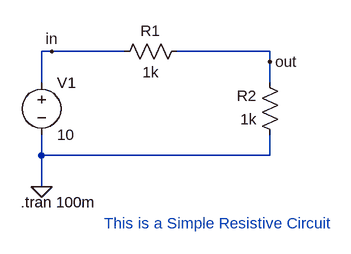
[diagram p0: schematic Simple_Resistive_Voltage_Divider.asc]
Simple_Resistive_Voltage_Divider.asc, the LTspice schematic file:
Version 4.1
SHEET 1 880 680
WIRE 0 112 -16 112
WIRE 112 112 0 112
WIRE 336 112 192 112
WIRE 336 128 336 112
WIRE -16 160 -16 112
WIRE 336 160 336 128
WIRE -16 272 -16 240
WIRE 336 272 336 240
WIRE 336 272 -16 272
WIRE -16 320 -16 272
FLAG -16 320 0
FLAG 336 128 out
FLAG 0 112 in
SYMBOL res 208 96 R90
WINDOW 0 0 56 VBottom 2
WINDOW 3 32 56 VTop 2
SYMATTR InstName R1
SYMATTR Value 1k
SYMBOL res 352 256 R180
WINDOW 0 36 76 Left 2
WINDOW 3 36 40 Left 2
SYMATTR InstName R2
SYMATTR Value 1k
SYMBOL voltage -16 144 R0
SYMATTR InstName V1
SYMATTR Value 10
TEXT -48 344 Left 2 !.tran 100m
TEXT 80 376 Left 2 ;This is a Simple Resistive Circuit

The netlist it stands for:
* Simple_Resistive_Voltage_Divider.asc
R1 out in 1k
R2 0 out 1k
V1 in 0 10
.tran 100m
* This is a Simple Resistive Circuit
.backanno
.end